# Altium schematic sheet CoproMKII_Connectors.SchDoc: Connectors
size B; Date: 01/17/2022; Author: Sample Author; Organization: ORGANIZATION; Address1: ADDRESS 1; Address2: ADDRESS 2; Address3: ADDRESS 3; Address4: ADDRESS 4; Revision: -; SheetNumber: 1; SheetTotal: 3; ENG_APP_DATE: --/--/--; DSN_APP_DATE: --/--/--; CHK_APP_DATE: --/--/--
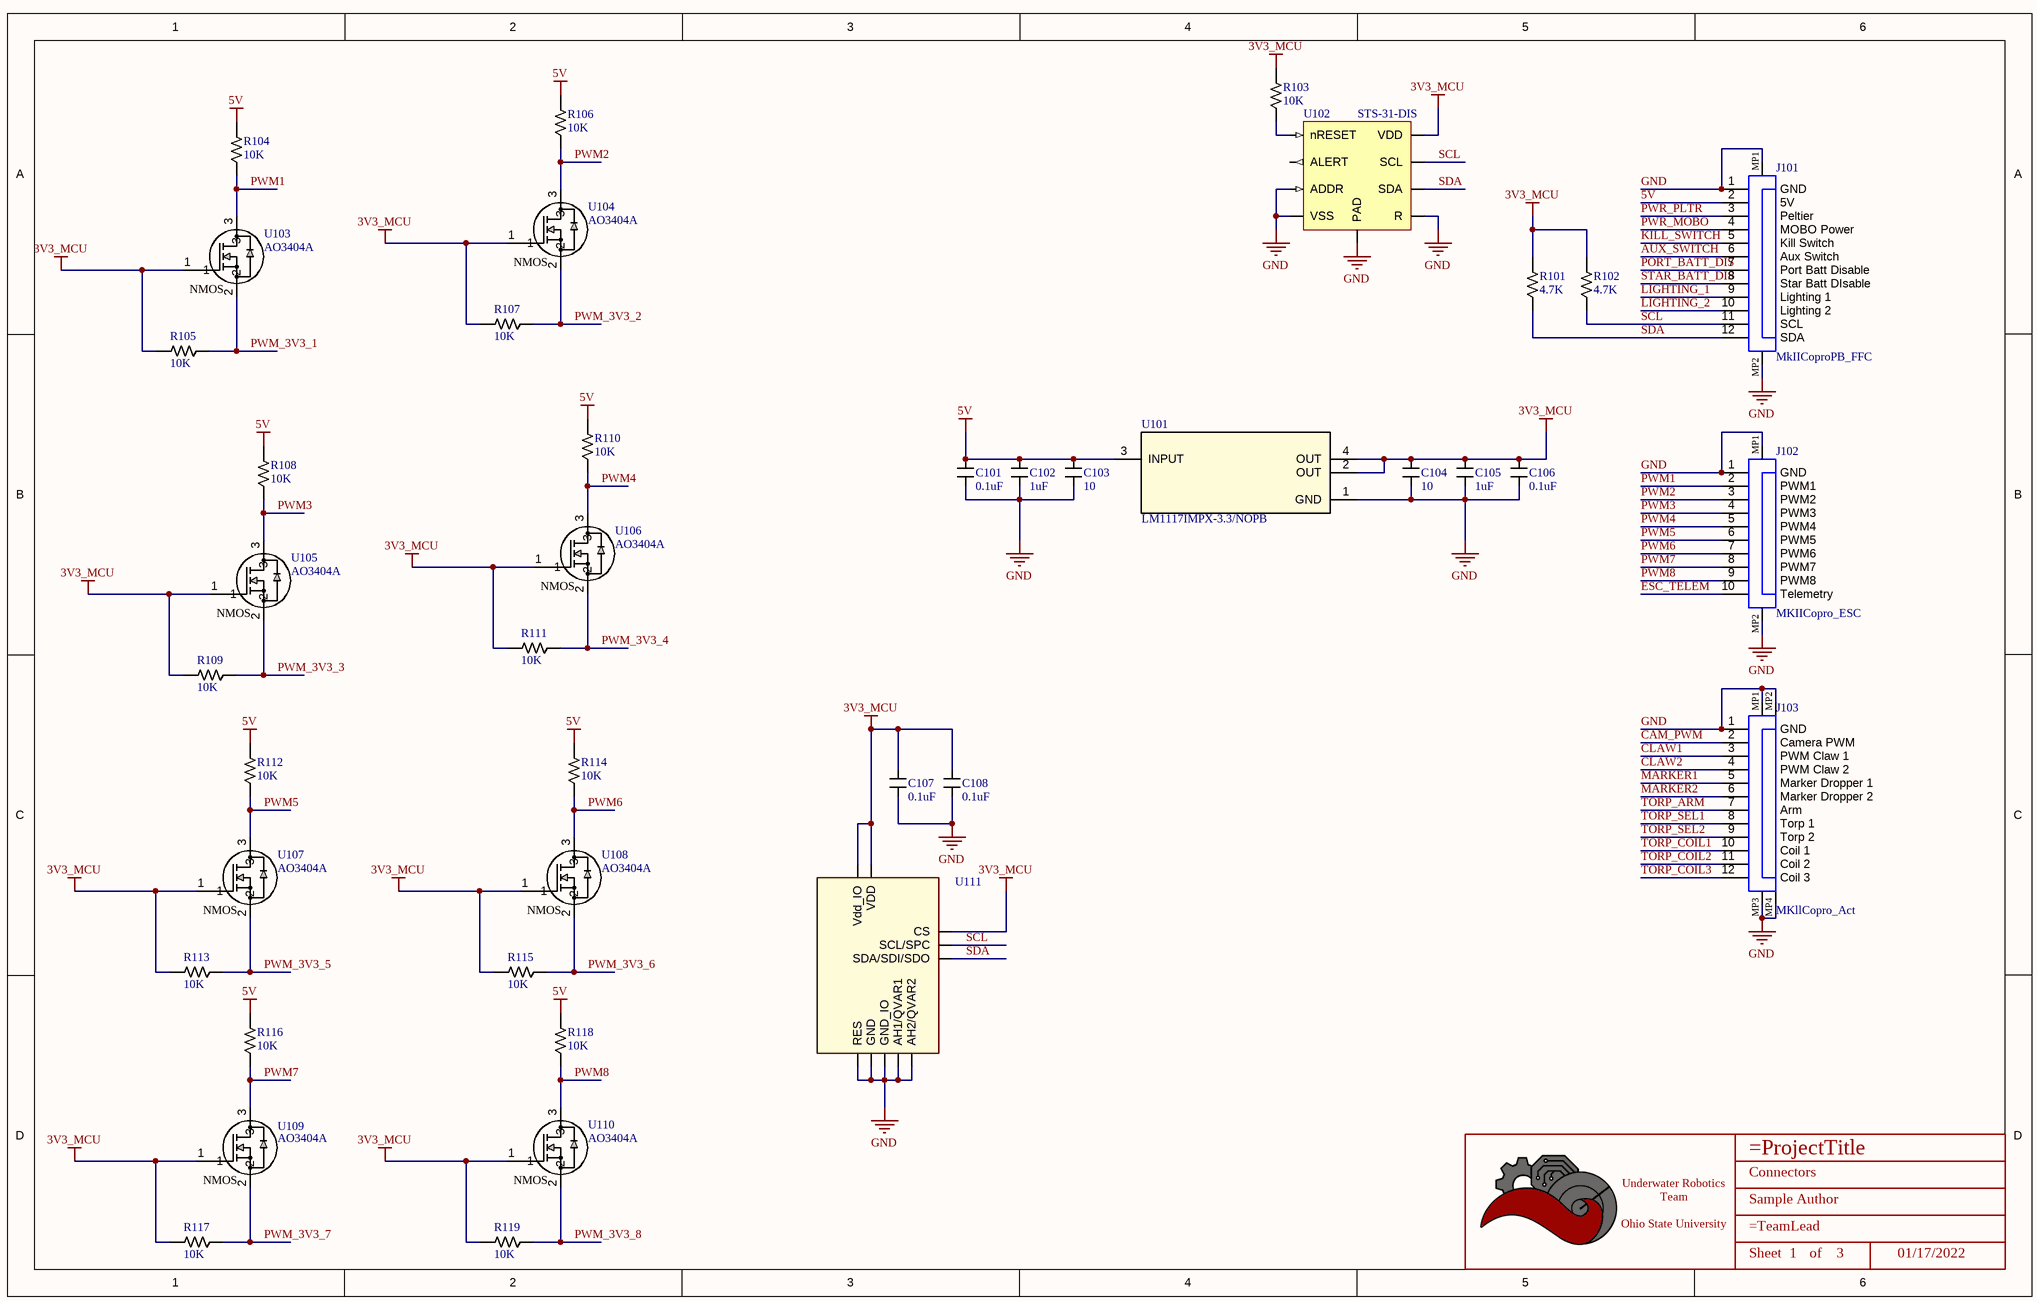
[diagram p0: CoproMKII_Connectors.SchDoc]

## Parts
*  Title_Block  [LOGO]  (value not drawn)  (graphical)
C101  value 0.1uF  [CAPACITOR_0603]  (hidden comment: 100nF Ceramic 6.3V)
C102  value 1uF  [CAPACITOR_0603]  (hidden comment: 1uF Ceramic 16V)
C103  Value (uF): 10  [CAPACITOR_0603]  (hidden comment: 10uF Ceramic 6.3V)
C104  Value (uF): 10  [CAPACITOR_0603]  (hidden comment: 10uF Ceramic 6.3V)
C105  value 1uF  [CAPACITOR_0603]  (hidden comment: 1uF Ceramic 16V)
C106  value 0.1uF  [CAPACITOR_0603]  (hidden comment: 100nF Ceramic 6.3V)
C107  value 0.1uF  [CAPACITOR_0603]  (hidden comment: 100nF Ceramic 6.3V)
C108  value 0.1uF  [CAPACITOR_0603]  (hidden comment: 100nF Ceramic 6.3V)
J101  MkIICoproPB_FFC  [68611214122]
J102  MKIICopro_ESC  [68611014122]
J103  MKllCopro_Act  [686112183822]
R101  Value  (Ohms): 4.7K  [RESISTOR_0805]  (hidden comment: 4.7k Ohm 5% 1/8W)
R102  Value  (Ohms): 4.7K  [RESISTOR_0805]  (hidden comment: 4.7k Ohm 5% 1/8W)
R103  Value  (Ohms): 10K  [RESISTOR_0603]  (hidden comment: 10k Ohm 5% 1/10W)
R104  Value  (Ohms): 10K  [RESISTOR_0603]  (hidden comment: 10k Ohm 5% 1/10W)
R105  Value  (Ohms): 10K  [RESISTOR_0603]  (hidden comment: 10k Ohm 5% 1/10W)
R106  Value  (Ohms): 10K  [RESISTOR_0603]  (hidden comment: 10k Ohm 5% 1/10W)
R107  Value  (Ohms): 10K  [RESISTOR_0603]  (hidden comment: 10k Ohm 5% 1/10W)
R108  Value  (Ohms): 10K  [RESISTOR_0603]  (hidden comment: 10k Ohm 5% 1/10W)
R109  Value  (Ohms): 10K  [RESISTOR_0603]  (hidden comment: 10k Ohm 5% 1/10W)
R110  Value  (Ohms): 10K  [RESISTOR_0603]  (hidden comment: 10k Ohm 5% 1/10W)
R111  Value  (Ohms): 10K  [RESISTOR_0603]  (hidden comment: 10k Ohm 5% 1/10W)
R112  Value  (Ohms): 10K  [RESISTOR_0603]  (hidden comment: 10k Ohm 5% 1/10W)
R113  Value  (Ohms): 10K  [RESISTOR_0603]  (hidden comment: 10k Ohm 5% 1/10W)
R114  Value  (Ohms): 10K  [RESISTOR_0603]  (hidden comment: 10k Ohm 5% 1/10W)
R115  Value  (Ohms): 10K  [RESISTOR_0603]  (hidden comment: 10k Ohm 5% 1/10W)
R116  Value  (Ohms): 10K  [RESISTOR_0603]  (hidden comment: 10k Ohm 5% 1/10W)
R117  Value  (Ohms): 10K  [RESISTOR_0603]  (hidden comment: 10k Ohm 5% 1/10W)
R118  Value  (Ohms): 10K  [RESISTOR_0603]  (hidden comment: 10k Ohm 5% 1/10W)
R119  Value  (Ohms): 10K  [RESISTOR_0603]  (hidden comment: 10k Ohm 5% 1/10W)
U101  LM1117IMPX-3.3/NOPB  [SOT-223-4]
U102  STS-31-DIS  [8-TDFN]
U103  AO3404A  [SOT-23-3]
U104  AO3404A  [SOT-23-3]
U105  AO3404A  [SOT-23-3]
U106  AO3404A  [SOT-23-3]
U107  AO3404A  [SOT-23-3]
U108  AO3404A  [SOT-23-3]
U109  AO3404A  [SOT-23-3]
U110  AO3404A  [SOT-23-3]
U111  ILPS22QSTR  [LGA10R50P2X3_200X200X80]  (value not drawn)

## Nets
3V3_MCU: C104.1 C105.1 C106.1 C107.1 C108.1 R101.1 R102.1 R103.1 R105.1 R107.1 R109.1 R111.1 R113.1 R115.1 R117.1 R119.1 U101.2(OUT) U101.4(OUT) U102.5(VDD) U103.1 U104.1 U105.1 U106.1 U107.1 U108.1 U109.1 U110.1 U111.1(Vdd_IO) U111.6(CS) U111.10(VDD)
5V: C101.1 C102.1 C103.1 J101.2(5V) R104.1 R106.1 R108.1 R110.1 R112.1 R114.1 R116.1 R118.1 U101.3(INPUT)
GND: C101.2 C102.2 C103.2 C104.2 C105.2 C106.2 C107.2 C108.2 J101.1(GND) J101.MP1 J101.MP2 J102.1(GND) J102.MP1 J102.MP2 J103.1(GND) J103.MP1 J103.MP2 J103.MP3 J103.MP4 U101.1(GND) U102.2(ADDR) U102.7(R) U102.8(VSS) U102.9(PAD) U111.3(RES) U111.5(AH2/QVAR2) U111.7(AH1/QVAR1) U111.8(GND_IO) U111.9(GND)
AUX_SWITCH: J101.6(Aux_Switch)
CAM_PWM: J103.2(Camera_PWM)
CLAW1: J103.3(PWM_Claw_1)
CLAW2: J103.4(PWM_Claw_2)
ESC_TELEM: J102.10(Telemetry)
KILL_SWITCH: J101.5(Kill_Switch)
LIGHTING_1: J101.9(Lighting_1)
LIGHTING_2: J101.10(Lighting_2)
MARKER1: J103.5(Marker_Dropper_1)
MARKER2: J103.6(Marker_Dropper_2)
PORT_BATT_DIS: J101.7(Port_Batt_Disable)
PWM1: J102.2(PWM1) R104.2 U103.3
PWM2: J102.3(PWM2) R106.2 U104.3
PWM3: J102.4(PWM3) R108.2 U105.3
PWM4: J102.5(PWM4) R110.2 U106.3
PWM5: J102.6(PWM5) R112.2 U107.3
PWM6: J102.7(PWM6) R114.2 U108.3
PWM7: J102.8(PWM7) R116.2 U109.3
PWM8: J102.9(PWM8) R118.2 U110.3
PWM_3V3_1: R105.2 U103.2
PWM_3V3_2: R107.2 U104.2
PWM_3V3_3: R109.2 U105.2
PWM_3V3_4: R111.2 U106.2
PWM_3V3_5: R113.2 U107.2
PWM_3V3_6: R115.2 U108.2
PWM_3V3_7: R117.2 U109.2
PWM_3V3_8: R119.2 U110.2
PWR_MOBO: J101.4(MOBO_Power)
PWR_PLTR: J101.3(Peltier)
SCL: J101.11(SCL) R102.2 U102.4(SCL) U111.2(SCL/SPC)
SDA: J101.12(SDA) R101.2 U102.1(SDA) U111.4(SDA/SDI/SDO)
STAR_BATT_DIS: J101.8(Star_Batt_DIsable)
TORP_ARM: J103.7(Arm)
TORP_COIL1: J103.10(Coil_1)
TORP_COIL2: J103.11(Coil_2)
TORP_COIL3: J103.12(Coil_3)
TORP_SEL1: J103.8(Torp_1)
TORP_SEL2: J103.9(Torp_2)
NetR103_2: R103.2 U102.6(nRESET)

Not connected (* = marked no-connect by the designer): U102 3(ALERT)

## Notes on the sheet
- DWG. NO.
- REV.
- SHT.
- THIS DOCUMENT AND THE DATA DISCLOSED HEREIN OR HEREWITH IS THE PROPERTY OF ALTIUM LIMITED AND MAY BE FREELY DISTRIBUTED IN WHOLE. NO RIGHTS ARE RESERVED OR EXPRESS OR IMPLIED WARANTEE GIVEN.
- REVISION
- DESCRIPTION
- DATE
- APPROVED
- ENG:
- APPROVALS
- PROJECT
- DSN:
- CHK:
- REFERENCE DOCUMENTS
- PROJECT REVISION:
- TITLE
- DOCUMENT REVISION:
- DESIGN ITEM:
- BOM:
- FAB DWG:
- PCB DWG:
- ASSY DWG:
- SCALE:
- SIZE
- B
- CAGE CODE
- FILE NAME
- DWG NO.
- SHEET
- OF
- REV
- (in symbol AO3404A) NMOS
- (in symbol Title_Block) Underwater Robotics Team / Ohio State University; Sheet; of

## Library data of the parts
* = Title_Block: UWRT Schematic Title Block Template / Created June 2021, Dylan Trainor
C101 C106-C108 = CAPACITOR_0.1uF_0603: Cap 100nF 6.3V +/-10% / Ceramic 0603; Made By: Flip B; ComponentLink1Description: Datsheet; ComponentLink1URL: https://www.mouser.com/datasheet/2/212/KEM_C1002_X7R_SMD-1102033.pdf; Tolerance: +/- 10%; Voltage: 6.3V; Supplier 1: Digi-Key; Supplier Part Number 1: 399-15351-1-ND
C102 C105 = CAPACITOR_1uF_0603: Cap 1uF 16V +/-10% / Ceramic 0603; Made By: Flip B; Tolerance: +/- 10%; Voltage: 16V; Supplier 1: Digi-Key; Supplier Part Number 1: 399-7847-1-ND
C103 C104 = CAPACITOR_10uF_0603: Cap 10uF 6.3V +/-20% / Ceramic 0603; Made By: Flip B; ComponentLink1Description: Digikey; ComponentLink1URL: https://www.digikey.com/en/products/detail/samsung-electro-mechanics/CL10A106MQ8NNNC/3886777; Supplier 1: Digi-Key; Supplier Part Number 1: 1276-1119-1-ND; Tolerance: +/- 20%; Voltage: 6.3V
J101 = MkIICoproPB_FFC: WR-FPC SMT ZIF Horizontal Top Contact, pitch 1mm, 12p; Manufacturer: Wurth Elektronik; Contact Resistance: 20mOhm; Pin Number: 12; Working Voltage: 125VAC; Rated Current: 1A; ComponentLink1Description: Manufacturer; ComponentLink1URL: http://www.we-online.de; ComponentLink2Description: Datasheet; ComponentLink2URL: https://katalog.we-online.com/em/datasheet/68611214122.pdf; Packaging: Tape and Reel; Pitch: 1mm; Published Date: March 2021; Mounting Technology: SMT; Operating Temperature: -25 to +85degC; Length: 19mm; Manufacturer Part Number: 68611214122; Type: Horizontal
J102 = MKIICopro_ESC: WR-FPC SMT ZIF Horizontal Top Contact, pitch 1mm, 10p; Manufacturer: Wurth Elektronik; Contact Resistance: 20mOhm; Pin Number: 10; Working Voltage: 125VAC; Rated Current: 1A; ComponentLink1Description: Manufacturer; ComponentLink1URL: http://www.we-online.de; ComponentLink2Description: Datasheet; ComponentLink2URL: https://katalog.we-online.com/em/datasheet/68611014122.pdf; Packaging: Tape and Reel; Pitch: 1mm; Published Date: March 2021; Mounting Technology: SMT; Operating Temperature: -25 to +85degC; Length: 17mm; Manufacturer Part Number: 68611014122; Type: Horizontal
J103 = MKllCopro_Act: WR-FPC SMT ZIF Vertical Type A, pitch 1mm, 12p; Manufacturer: Wurth Elektronik; Contact Resistance: 30mOhm; Pin Number: 12; Working Voltage: 125VAC; Rated Current: 1A; ComponentLink1Description: Manufacturer; ComponentLink1URL: http://www.we-online.de; ComponentLink2Description: Datasheet; ComponentLink2URL: https://katalog.we-online.com/em/datasheet/686112183822.pdf; Packaging: Tape and Reel; Pitch: 1mm; Published Date: March 2021; Mounting Technology: SMT; Operating Temperature: -25 to +85degC; Length: 18.8mm; Manufacturer Part Number: 686112183822; Type: Vertical
R101 R102 = RESISTOR_4.7K_0805: RES 4.7k OHM 5% 1/8W 0805; Tolerance: +/- 5%; Made By: Robert Pafford; ComponentLink1Description: Datasheet; Wattage: 1/8W; Supplier: Digikey; Digikey Part Numer: CR0603-JW-104ELFTR-ND
R103-R119 = RESISTOR_10K_0603: RES 10k OHM 5% 1/10W 0603; Tolerance: +/- 5%; Wattage: 1/8W; Made By: Robert Pafford; ComponentLink1Description: Datasheet; ComponentLink1URL: https://www.bourns.com/docs/product-datasheets/CRxxxxx.pdf; Supplier: Digikey; Digikey Part Numer: CR0603-JW-104ELFTR-ND; Supplier 1: Digi-Key; Supplier Part Number 1: 2019-RK73B1JTTD103JCT-ND
U101 = LM1117IMPX-3.3/NOPB: IC REG LIN 3.3V 800MA SOT223-4; PartNumber: LM1117IMP-3.3/NOPB; Manufacturer: Texas Instruments; Vin (Max): 15V; Supplier 1: Digi-Key; Supplier Part Number 1: LM1117IMPX-3.3/NOPBCT-ND; Vout (Min/Fixed): 3.3V; Amp Out: 800mA; Package: SOT-223-4; Created By: Dylan T
U102 = STS-31-DIS: Temperature Sensor Digital, Local 0°C ~ 90°C 16 b 8-TDFN (2.5x2.5); Accuracy: ±0.2°C; Operating Range: -40°C ~ 125°C; Interface: I2C; Resolution: 16b; Operating Voltage: 2.15V ~ 5.5V; Made By: Robert Pafford; Supplier 1: Digi-Key; Supplier Part Number 1: 1649-1064-1-ND; Accuracy Range: 0°C ~ 90°C
U103-U110 = AO3404A: N-Channel 30 V 5.8A (Ta) 1.4W (Ta) Surface Mount SOT-23-3; Vendor: Alpha & Omega Semiconductor Inc.; SourceLibrary: ON_Semiconductor_2020-01-13; Vgs (Max): 3V @ 5.8A, 10V; Vgs (th): 3V @ 250µA; Vdss: 30V; Rds (on): 28mOhm @ 5.8A, 10V; Amp Rating: 5.8 A; FET Type: N-Channel; Package: SOT23-3L; Manufacturer _Part_Number: AO3404A; Power Dissipation: 1.4W (Ta); Supplier 1: Digi-Key; Supplier Part Number 1: 785-1004-1-ND; Created By: Dylan T
U111 = ILPS22QSTR: Board Mount Pressure Sensors Dual full-scale 1260hPa 4060hPa absolute digital output barometer embedded Qvar. I2C and SPI; Supplier 1: Mouser; Supplier Part Number 1: 511-ILPS22QSTR